# Altium schematic sheet 13-CrosslinkNX_FPGA.SchDoc
size B; SheetNumber: 13; SheetTotal: 14
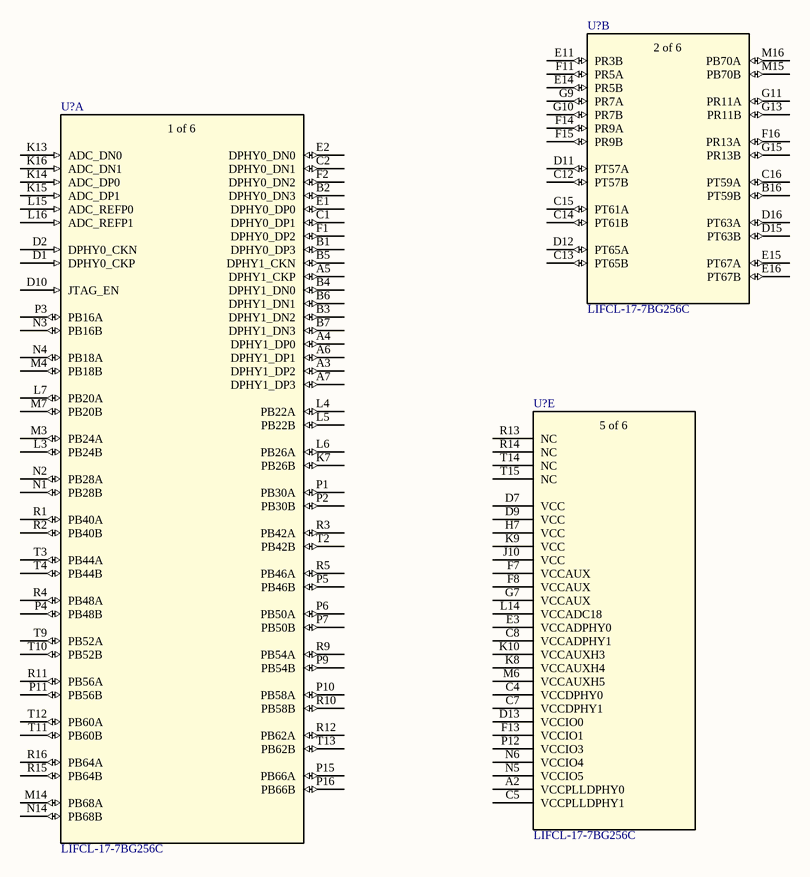
[diagram p0: 13-CrosslinkNX_FPGA.SchDoc]

## Parts
(Parts that share a designator on the sheet are numbered #1, #2 ... from top to bottom, then left to right.)
U?#1  LIFCL-17-7BG256C  [caBGA256_LAT]  (part B of 6)
U?#2  LIFCL-17-7BG256C  [caBGA256_LAT]  (part A of 6)
U?#3  LIFCL-17-7BG256C  [caBGA256_LAT]  (part E of 6)

## Nets

Not connected (* = marked no-connect by the designer): U?#1 B16(PT59B) C12(PT57B) C13(PT65B) C14(PT61B) C15(PT61A) C16(PT59A) D11(PT57A) D12(PT65A) D15(PT63B) D16(PT63A) E11(PR3B) E14(PR5B) E15(PT67A) E16(PT67B) F11(PR5A) F14(PR9A) F15(PR9B) F16(PR13A) G9(PR7A) G10(PR7B) G11(PR11A) G13(PR11B) G15(PR13B) M15(PB70B) M16(PB70A); U?#2 A3(DPHY1_DP2) A4(DPHY1_DP0) A5(DPHY1_CKP) A6(DPHY1_DP1) A7(DPHY1_DP3) B1(DPHY0_DP3) B2(DPHY0_DN3) B3(DPHY1_DN2) B4(DPHY1_DN0) B5(DPHY1_CKN) B6(DPHY1_DN1) B7(DPHY1_DN3) C1(DPHY0_DP1) C2(DPHY0_DN1) D1(DPHY0_CKP) D2(DPHY0_CKN) D10(JTAG_EN) E1(DPHY0_DP0) E2(DPHY0_DN0) F1(DPHY0_DP2) F2(DPHY0_DN2) K7(PB26B) K13(ADC_DN0) K14(ADC_DP0) K15(ADC_DP1) K16(ADC_DN1) L3(PB24B) L4(PB22A) L5(PB22B) L6(PB26A) L7(PB20A) L15(ADC_REFP0) L16(ADC_REFP1) M3(PB24A) M4(PB18B) M7(PB20B) M14(PB68A) N1(PB28B) N2(PB28A) N3(PB16B) N4(PB18A) N14(PB68B) P1(PB30A) P2(PB30B) P3(PB16A) P4(PB48B) P5(PB46B) P6(PB50A) P7(PB50B) P9(PB54B) P10(PB58A) P11(PB56B) P15(PB66A) P16(PB66B) R1(PB40A) R2(PB40B) R3(PB42A) R4(PB48A) R5(PB46A) R9(PB54A) R10(PB58B) R11(PB56A) R12(PB62A) R15(PB64B) R16(PB64A) T2(PB42B) T3(PB44A) T4(PB44B) T9(PB52A) T10(PB52B) T11(PB60B) T12(PB60A) T13(PB62B); U?#3 A2(VCCPLLDPHY0) C4(VCCDPHY0) C5(VCCPLLDPHY1) C7(VCCDPHY1) C8(VCCADPHY1) D7(VCC) D9(VCC) D13(VCCIO0) E3(VCCADPHY0) F7(VCCAUX) F8(VCCAUX) F13(VCCIO1) G7(VCCAUX) H7(VCC) J10(VCC) K8(VCCAUXH4) K9(VCC) K10(VCCAUXH3) L14(VCCADC18) M6(VCCAUXH5) N5(VCCIO5) N6(VCCIO4) P12(VCCIO3) R13(NC) R14(NC) T14(NC) T15(NC)

## Notes on the sheet
- (in symbol LIFCL-17-7BG256C, part A) 1 of 6
- (in symbol LIFCL-17-7BG256C, part B) 2 of 6
- (in symbol LIFCL-17-7BG256C, part E) 5 of 6

## Library data of the parts
U?#1-U?#3 = LIFCL-17-7BG256C: No Description Available; Mfr_Name: Lattice; RefDes: RefDes; Type: Type